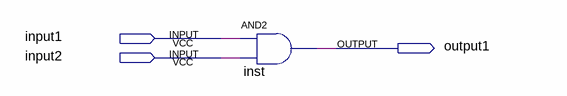
[diagram p0: schematic sheet]
// Quartus schematic Test.bdf as structural Verilog: 1 symbols, 3 pins
module Test (
  input  input1,
  input  input2,
  output output1
);

  and inst (output1, input1, input2);
endmodule
